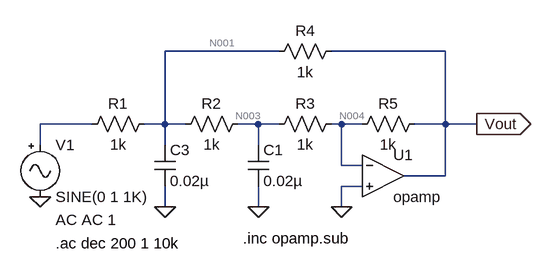
[diagram p0: schematic (-) Gain VCVS lowpass.asc]
(-) Gain VCVS lowpass.asc, the LTspice schematic file:
Version 4
SHEET 1 880 680
WIRE 400 80 224 80
WIRE 656 80 480 80
WIRE 112 192 32 192
WIRE 224 192 224 80
WIRE 224 192 192 192
WIRE 256 192 224 192
WIRE 368 192 336 192
WIRE 400 192 368 192
WIRE 496 192 480 192
WIRE 528 192 496 192
WIRE 656 192 656 80
WIRE 656 192 608 192
WIRE 704 192 656 192
WIRE 32 224 32 192
WIRE 224 224 224 192
WIRE 368 224 368 192
WIRE 496 256 496 192
WIRE 528 256 496 256
WIRE 656 272 656 192
WIRE 656 272 592 272
WIRE 528 288 496 288
WIRE 224 320 224 288
WIRE 368 320 368 288
WIRE 496 320 496 288
FLAG 704 192 Vout
IOPIN 704 192 Out
FLAG 32 304 0
FLAG 368 320 0
FLAG 224 320 0
FLAG 496 320 0
SYMBOL res 208 176 R90
WINDOW 0 0 56 VBottom 2
WINDOW 3 32 56 VTop 2
SYMATTR InstName R1
SYMATTR Value 1k
SYMBOL res 352 176 R90
WINDOW 0 0 56 VBottom 2
WINDOW 3 32 56 VTop 2
SYMATTR InstName R2
SYMATTR Value 1k
SYMBOL cap 352 224 R0
SYMATTR InstName C1
SYMATTR Value 0.02µ
SYMBOL Misc\\signal 32 208 R0
WINDOW 123 24 132 Left 2
WINDOW 39 0 0 Left 0
SYMATTR Value2 AC AC 1
SYMATTR InstName V1
SYMBOL cap 208 224 R0
SYMATTR InstName C3
SYMATTR Value 0.02µ
SYMBOL res 496 176 R90
WINDOW 0 0 56 VBottom 2
WINDOW 3 32 56 VTop 2
SYMATTR InstName R3
SYMATTR Value 1k
SYMBOL res 496 64 R90
WINDOW 0 0 56 VBottom 2
WINDOW 3 32 56 VTop 2
SYMATTR InstName R4
SYMATTR Value 1k
SYMBOL OpAmps\\opamp 560 208 R0
SYMATTR InstName U1
SYMBOL res 624 176 R90
WINDOW 0 0 56 VBottom 2
WINDOW 3 32 56 VTop 2
SYMATTR InstName R5
SYMATTR Value 1k
TEXT 56 376 Left 2 !.ac dec 200 1 10k
TEXT 344 368 Left 2 !.inc opamp.sub

The netlist it stands for:
* (-) Gain VCVS lowpass.asc
R1 N001 N002 1k
R2 N003 N001 1k
C1 N003 0 0.02µ
V1 N002 0 SINE(0 1 1K) AC AC 1
C3 N001 0 0.02µ
R3 N004 N003 1k
R4 Vout N001 1k
XU1 N004 0 Vout opamp Aol=100K GBW=10Meg  ; pins invin noninvin out
R5 Vout N004 1k
.ac dec 200 1 10k
.inc opamp.sub
.backanno
.end

* Results of the author's LTspice run, read from the files saved beside the schematic
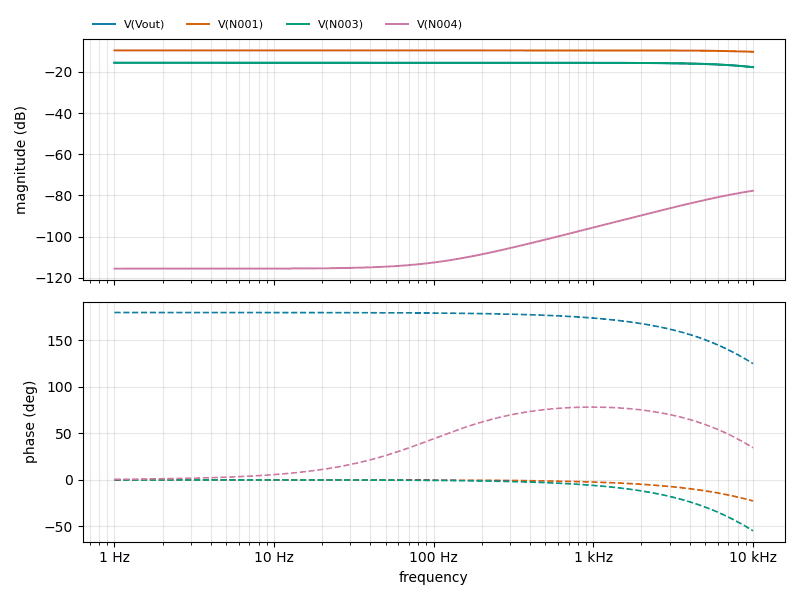
[diagram p1: AC Analysis of (-) Gain VCVS lowpass.asc, plotted from the saved traces]
* AC Analysis, 1 run:
*   V(Vout): -15.56 dB at 1 Hz, -17.71 dB at 10 kHz, peak -15.56 dB at 1 Hz
*   V(N001): -9.54 dB at 1 Hz, -10.24 dB at 10 kHz, peak -9.54 dB at 1 Hz
*   V(N003): -15.56 dB at 1 Hz, -17.71 dB at 10 kHz, peak -15.56 dB at 1 Hz
*   V(N004): -115.53 dB at 1 Hz, -77.71 dB at 10 kHz, peak -77.71 dB at 10 kHz, 3 dB below the peak at 6.106 kHz